# Altium schematic sheet main.SchDoc
size A4
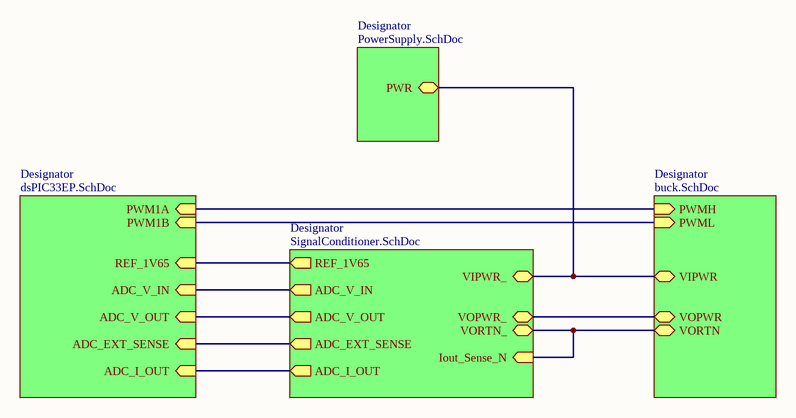
[diagram p0: main.SchDoc]

## Sub-sheets
Designator = buck.SchDoc: VIPWR (bidir), PWML (in), PWMH (in), VOPWR (bidir), VORTN (bidir)
Designator = dsPIC33EP.SchDoc: ADC_V_OUT (in), ADC_EXT_SENSE (in), PWM1A (in), REF_1V65 (in), PWM1B (in), ADC_V_IN (in), ADC_I_OUT (in)
Designator = PowerSupply.SchDoc: PWR (bidir)
Designator = SignalConditioner.SchDoc: Iout_Sense_N (in), ADC_V_OUT (out), ADC_I_OUT (out), REF_1V65 (out), ADC_EXT_SENSE (out), ADC_V_IN (out), VIPWR_ (bidir), VORTN_ (bidir), VOPWR_ (bidir)

## Nets
(unnamed): sheet Designator/VIPWR, sheet Designator/PWR, sheet Designator/VIPWR_
(unnamed): sheet Designator/PWML, sheet Designator/PWM1B
(unnamed): sheet Designator/PWMH, sheet Designator/PWM1A
(unnamed): sheet Designator/VOPWR, sheet Designator/VOPWR_
(unnamed): sheet Designator/VORTN, sheet Designator/Iout_Sense_N, sheet Designator/VORTN_
(unnamed): sheet Designator/ADC_V_OUT, sheet Designator/ADC_V_OUT
(unnamed): sheet Designator/ADC_EXT_SENSE, sheet Designator/ADC_EXT_SENSE
(unnamed): sheet Designator/REF_1V65, sheet Designator/REF_1V65
(unnamed): sheet Designator/ADC_V_IN, sheet Designator/ADC_V_IN
(unnamed): sheet Designator/ADC_I_OUT, sheet Designator/ADC_I_OUT